# Altium schematic sheet RF.SchDoc
size A
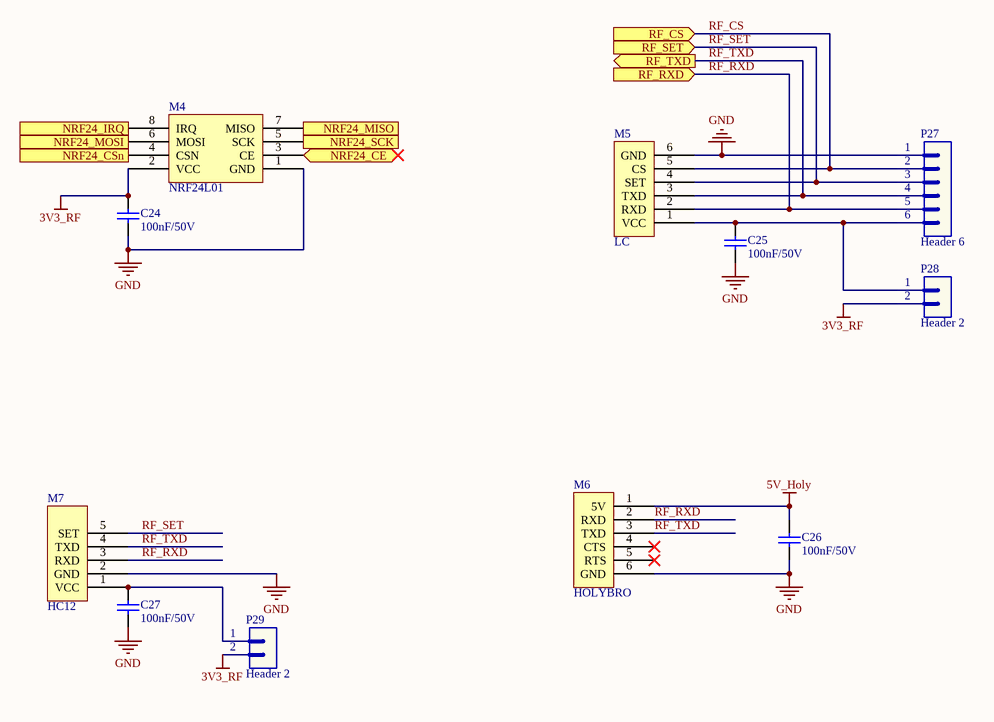
[diagram p0: RF.SchDoc]

## Parts
C24  value 100nF/50V  [CAP-SM-0805]  (hidden comment: Cap-100nF-50V-0805)
C25  value 100nF/50V  [CAP-SM-0805]  (hidden comment: Cap-100nF-50V-0805)
C26  value 100nF/50V  [CAP-SM-0805]  (hidden comment: Cap-100nF-50V-0805)
C27  value 100nF/50V  [CAP-SM-0805]  (hidden comment: Cap-100nF-50V-0805)
M4  NRF24L01  [NRF24L01]
M5  LC  [LC12S]
M6  HOLYBRO  [HOLYBRO]
M7  HC12  [HC12]
P27  Header 6  [JP6]
P28  Header 2  [JP2]
P29  Header 2  [JP2]

## Ports
NRF24_CE (bidir), NRF24_CSn (in), NRF24_IRQ (out), NRF24_MISO (out), NRF24_MOSI (in), NRF24_SCK (in), RF_CS (in), RF_RXD (in), RF_SET (in), RF_TXD (out)

## Nets
3V3_RF: C24.2 M4.2(VCC) P28.2 P29.2
5V_Holy: C26.2 M6.1(5V)
GND: C24.1 C25.1 C26.1 C27.1 M4.1(GND) M5.6(GND) M6.6(GND) M7.2(GND) P27.1
NRF24_CE: M4.3(CE) ; port NRF24_CE
NRF24_CSn: M4.4(CSN) ; port NRF24_CSn
NRF24_IRQ: M4.8(IRQ) ; port NRF24_IRQ
NRF24_MISO: M4.7(MISO) ; port NRF24_MISO
NRF24_MOSI: M4.6(MOSI) ; port NRF24_MOSI
NRF24_SCK: M4.5(SCK) ; port NRF24_SCK
RF_CS: M5.5(CS) P27.2 ; port RF_CS
RF_RXD: M5.2(RXD) M6.2(RXD) M7.3(RXD) P27.5 ; port RF_RXD
RF_SET: M5.4(SET) M7.5(SET) P27.3 ; port RF_SET
RF_TXD: M5.3(TXD) M6.3(TXD) M7.4(TXD) P27.4 ; port RF_TXD
NetC25_2: C25.2 M5.1(VCC) P27.6 P28.1
NetC27_2: C27.2 M7.1(VCC) P29.1

Not connected (* = marked no-connect by the designer): M6 4(CTS)* 5(RTS)*

## Library data of the parts
C24-C27 = Cap-100nF-50V-0805: CAP CER 0.1UF 50V Y5V 0805; Manufacturer: Samsung Electro-Mechanics; Manufacturer Part Number: CL21F104ZBCNNNC; Local Supplier: thegioiic; Local Supplier Link: https://thegioiic.com/products/tu-100nf-0-1uf-50v-0805; Supplier 1: Digikey; Supplier 1 Part Number: 1276-1007-1-ND; Supplier 1 Link: https://www.digikey.com/product-detail/en/samsung-electro-mechanics/CL21F104ZBCNNNC/1276-1007-1-ND/3889093
M5 = LC12S
P27 = Header 6: Header, 6-Pin; LatestRevisionDate: 17-Jul-2002; LatestRevisionNote: Re-released for DXP Platform.; Publisher: Altium Limited
P28 P29 = Header 2: Header, 2-Pin; LatestRevisionDate: 17-Jul-2002; LatestRevisionNote: Re-released for DXP Platform.; Publisher: Altium Limited